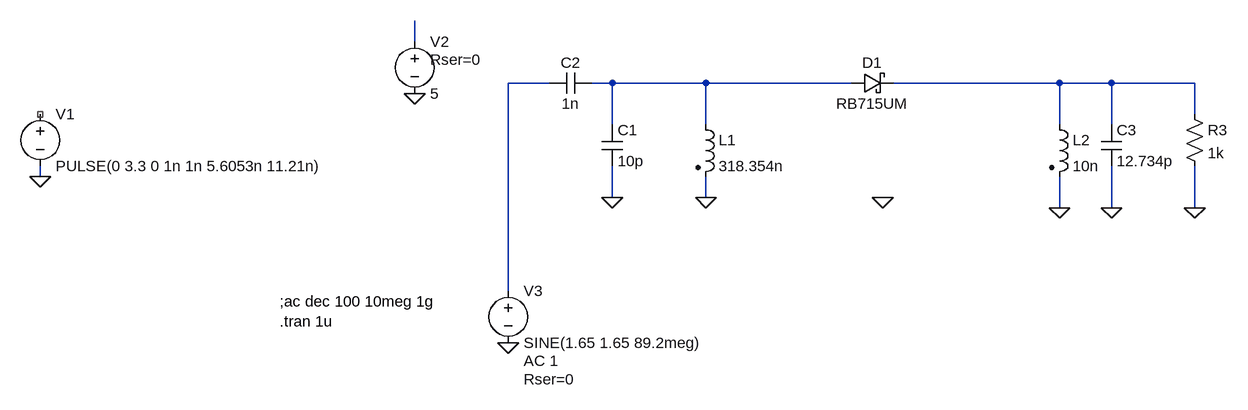
[diagram p0: schematic 5x multiplier.asc]
5x multiplier.asc, the LTspice schematic file:
Version 4
SHEET 1 880 680
WIRE -384 -256 -384 -288
WIRE -176 -192 -240 -192
WIRE -80 -192 -112 -192
WIRE 64 -192 -80 -192
WIRE 288 -192 64 -192
WIRE 608 -192 352 -192
WIRE 688 -192 608 -192
WIRE 816 -192 688 -192
WIRE 816 -144 816 -192
WIRE -80 -128 -80 -192
WIRE 64 -128 64 -192
WIRE 608 -128 608 -192
WIRE 688 -128 688 -192
WIRE -960 -48 -960 -64
WIRE -80 -16 -80 -64
WIRE 64 -16 64 -48
WIRE 608 0 608 -48
WIRE 688 0 688 -64
WIRE 816 0 816 -64
WIRE -240 128 -240 -192
FLAG -960 -48 0
FLAG -384 -176 0
FLAG -240 208 0
FLAG 608 0 0
FLAG 816 0 0
FLAG 688 0 0
FLAG -80 -16 0
FLAG 64 -16 0
FLAG 336 -16 0
SYMBOL voltage -960 -160 R0
WINDOW 123 0 0 Left 0
WINDOW 39 0 0 Left 0
SYMATTR InstName V1
SYMATTR Value PULSE(0 3.3 0 1n 1n 5.6053n 11.21n)
SYMBOL voltage -384 -272 R0
WINDOW 123 0 0 Left 0
WINDOW 39 24 44 Left 2
SYMATTR SpiceLine Rser=0
SYMATTR InstName V2
SYMATTR Value 5
SYMBOL voltage -240 112 R0
WINDOW 123 24 124 Left 2
WINDOW 39 24 152 Left 2
SYMATTR Value2 AC 1
SYMATTR SpiceLine Rser=0
SYMATTR InstName V3
SYMATTR Value SINE(1.65 1.65 89.2meg)
SYMBOL ind2 592 -144 R0
SYMATTR InstName L2
SYMATTR Value 10n
SYMATTR SpiceLine Rser=0.1
SYMATTR Type ind
SYMBOL res 800 -160 R0
SYMATTR InstName R3
SYMATTR Value 1k
SYMBOL cap 672 -128 R0
SYMATTR InstName C3
SYMATTR Value 12.734p
SYMBOL ind2 48 -144 R0
SYMATTR InstName L1
SYMATTR Value 318.354n
SYMATTR Type ind
SYMBOL cap -96 -128 R0
SYMATTR InstName C1
SYMATTR Value 10p
SYMBOL schottky 288 -176 R270
WINDOW 0 32 32 VTop 2
WINDOW 3 0 32 VBottom 2
SYMATTR InstName D1
SYMATTR Value RB715UM
SYMATTR Description Diode
SYMATTR Type diode
SYMBOL cap -112 -208 R90
WINDOW 0 0 32 VBottom 2
WINDOW 3 32 32 VTop 2
SYMATTR InstName C2
SYMATTR Value 1n
TEXT -592 144 Left 2 !;ac dec 100 10meg 1g\n.tran 1u

The netlist it stands for:
* 5x multiplier.asc
V1 NC_01 0 PULSE(0 3.3 0 1n 1n 5.6053n 11.21n)
V2 N001 0 5 Rser=0
V3 N002 0 SINE(1.65 1.65 89.2meg) AC 1 Rser=0
L2 N004 0 10n Rser=0.1
R3 N004 0 1k
C3 N004 0 12.734p
L1 N003 0 318.354n
C1 N003 0 10p
D1 N003 N004 RB715UM
C2 N003 N002 1n
.model D D
.lib standard.dio
;ac dec 100 10meg 1g
.tran 1u
.backanno
.end